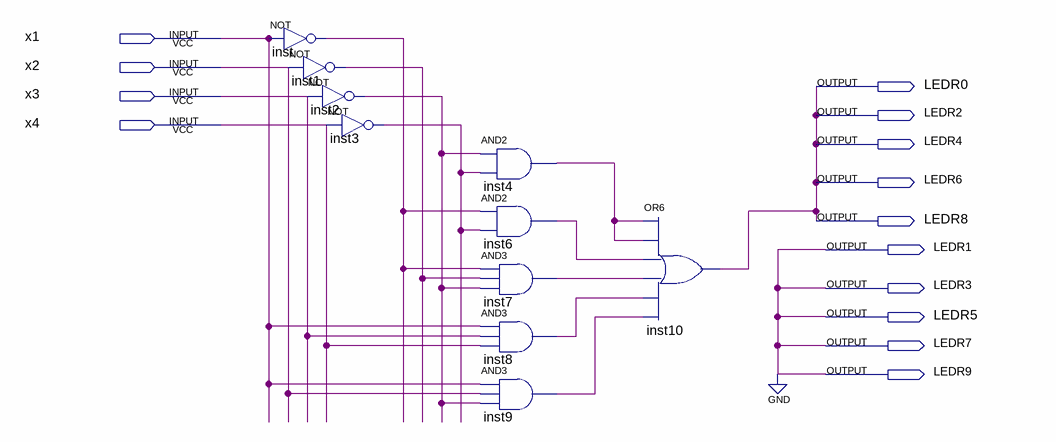
[diagram p0: schematic sheet]
// Quartus schematic Lab1.bdf as structural Verilog: 10 symbols, 14 pins
module Lab1 (
  input  x1,
  input  x2,
  input  x3,
  input  x4,
  output LEDR0,
  output LEDR2,
  output LEDR4,
  output LEDR6,
  output LEDR8,
  output LEDR1,
  output LEDR3,
  output LEDR5,
  output LEDR7,
  output LEDR9
);

  wire inst1_out, inst2_out, inst3_out, inst4_out, inst6_out, inst7_out, inst8_out, inst9_out, inst_out;

  not inst (inst_out, x1);
  not inst1 (inst1_out, x2);
  not inst2 (inst2_out, x3);
  not inst3 (inst3_out, x4);
  and inst4 (inst4_out, inst2_out, inst3_out);
  and inst6 (inst6_out, inst_out, inst3_out);
  and inst7 (inst7_out, inst_out, inst1_out, inst2_out);
  and inst8 (inst8_out, x1, x3, x4);
  and inst9 (inst9_out, x1, x2, inst2_out);
  or inst10 (LEDR0, inst4_out, inst4_out, inst6_out, inst7_out, inst8_out, inst9_out);

  assign LEDR1 = 1'b0;
  assign LEDR2 = LEDR0;
  assign LEDR3 = 1'b0;
  assign LEDR4 = LEDR0;
  assign LEDR5 = 1'b0;
  assign LEDR6 = LEDR0;
  assign LEDR7 = 1'b0;
  assign LEDR8 = LEDR0;
  assign LEDR9 = 1'b0;
endmodule
